# EAGLE design test2 (EAGLE 7.3.0)
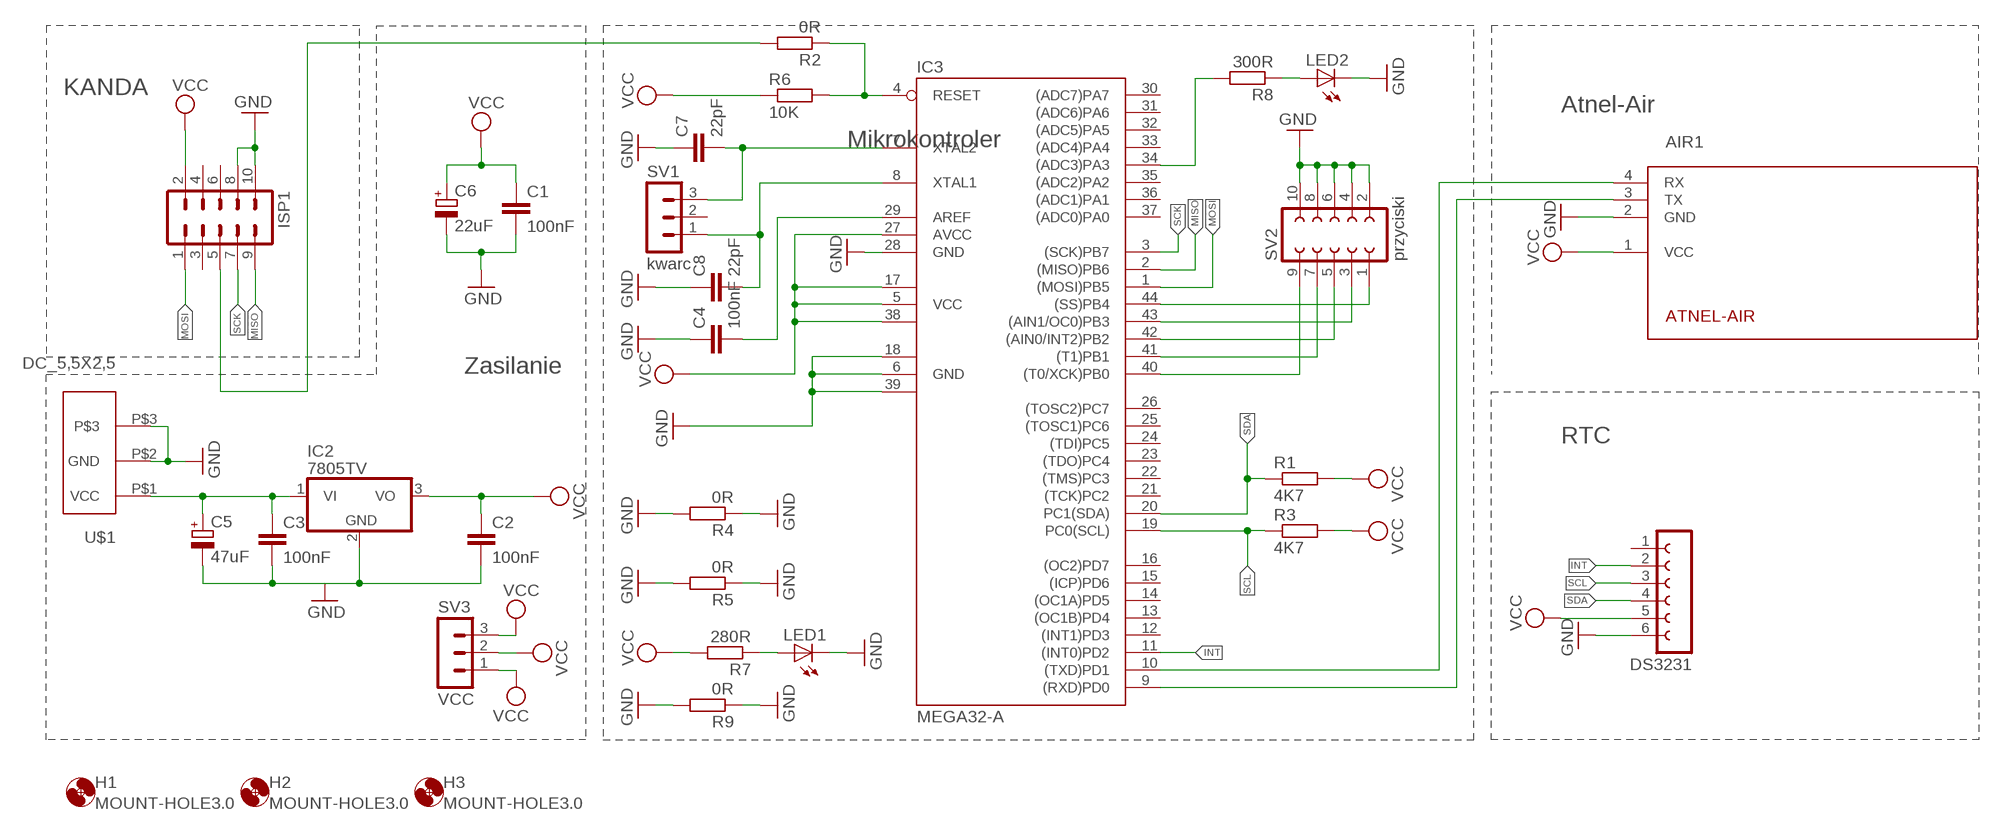
[diagram p0: schematic, sheet 1]

## Parts
AIR1  ATNEL-AIR  [ATNEL-AIR]
C1  100nF  C-EU025-024X044  [C025-024X044]
C2  100nF  C-EU025-024X044  [C025-024X044]
C3  100nF  C-EU025-024X044  [C025-024X044]
C4  100nF  C-EU025-024X044  [C025-024X044]
C5  47uF  CPOL-EUB45181A  [B45181A]
C6  22uF  CPOL-EUB45181A  [B45181A]
C7  22pF  C-EU025-024X044  [C025-024X044]
C8  22pF  C-EU025-024X044  [C025-024X044]
DS3231  FE06-1  [FE06]
H1  MOUNT-HOLE3.0  [3,0]
H2  MOUNT-HOLE3.0  [3,0]
H3  MOUNT-HOLE3.0  [3,0]
IC2  7805TV  [TO220V]
IC3  MEGA32-A  [TQFP44]
ISP1  ML10  [ML10]
LED1  LED5MM  [LED5MM]
LED2  LED5MM  [LED5MM]
R1  4K7  R-EU_R1206W  [R1206W]
R2  0R  R-EU_R1206W  [R1206W]
R3  4K7  R-EU_R1206W  [R1206W]
R4  0R  R-EU_R1206W  [R1206W]
R5  0R  R-EU_R1206W  [R1206W]
R6  10K  R-EU_R1206W  [R1206W]
R7  280R  R-EU_R1206W  [R1206W]
R8  300R  R-EU_R1206W  [R1206W]
R9  0R  R-EU_R1206W  [R1206W]
SV1  kwarc  MA03-1  [MA03-1]
SV2  przyciski  FE05-2  [FE05-2]
SV3  VCC  MA03-1  [MA03-1]
U$1  DC_5,5X2,5  [DC_5,5X2,5]

## Nets
GND: AIR1.2(GND) C1.2 C2.2 C3.2 C4.1 C5.- C6.- C7.1 C8.1 DS3231.6 IC2.2(GND) IC3.6(GND) IC3.18(GND1) IC3.28(GND) IC3.39(GND2) ISP1.8 ISP1.10 LED1.K(C) LED2.K(C) R4.1 R4.2 R5.1 R5.2 R9.1 R9.2 SV2.2 SV2.4 SV2.6 SV2.8 SV2.10 U$1.P$2(GND) U$1.P$3
INT: DS3231.2 IC3.11((INT0)PD2)
MISO: IC3.2((MISO)PB6) ISP1.9
MOSI: IC3.1((MOSI)PB5) ISP1.1
N$1: AIR1.4(RX) IC3.10((TXD)PD1)
N$2: AIR1.3(TX) IC3.9((RXD)PD0)
N$3: C4.2 IC3.29(AREF)
N$4: IC3.44((SS)PB4) SV2.1
N$5: IC3.43((AIN1/OC0)PB3) SV2.3
N$6: C3.1 C5.+ IC2.1(VI) U$1.P$1(VCC)
N$7: IC3.42((AIN0/INT2)PB2) SV2.5
N$8: IC3.41((T1)PB1) SV2.7
N$9: IC3.40((T0/XCK)PB0) SV2.9
N$10: C7.2 IC3.7(XTAL2) SV1.3
N$11: C8.2 IC3.8(XTAL1) SV1.1
N$12: LED1.A R7.1
N$16: LED2.A R8.1
N$17: IC3.34((ADC3)PA3) R8.2
RST: IC3.4(RESET) ISP1.5 R2.1 R2.2 R6.2
SCK: IC3.3((SCK)PB7) ISP1.7
SCL: DS3231.3 IC3.19(PC0(SCL)) R3.1
SDA: DS3231.4 IC3.20(PC1(SDA)) R1.1
VCC: AIR1.1(VCC) C1.1 C2.1 C6.+ DS3231.5 IC2.3(VO) IC3.5(VCC) IC3.17(VCC1) IC3.27(AVCC) IC3.38(VCC2) ISP1.2 R1.2 R3.2 R6.1 R7.2 SV3.1 SV3.2 SV3.3
Unconnected: DS3231.1 IC3.12((INT1)PD3) IC3.13((OC1B)PD4) IC3.14((OC1A)PD5) IC3.15((ICP)PD6) IC3.16((OC2)PD7) IC3.21((TCK)PC2) IC3.22((TMS)PC3) IC3.23((TDO)PC4) IC3.24((TDI)PC5) IC3.25((TOSC1)PC6) IC3.26((TOSC2)PC7) IC3.30((ADC7)PA7) IC3.31((ADC6)PA6) IC3.32((ADC5)PA5) IC3.33((ADC4)PA4) IC3.35((ADC2)PA2) IC3.36((ADC1)PA1) IC3.37((ADC0)PA0) ISP1.3 ISP1.4 ISP1.6 SV1.2

## Notes on the sheet
- KANDA
- Atnel-Air
- Mikrokontroler
- Zasilanie
- RTC

## Library data of the parts
AIR1 = ATNEL-WIFI232-T:ATNEL-AIR
C1-C4 C7 C8 = rcl:C-EU: CAPACITOR, European symbol
C5 C6 = rcl:CPOL-EU: POLARIZED CAPACITOR, European symbol
DS3231 = con-lsta:FE06-1: FEMALE HEADER; OC_FARNELL: unknown; OC_NEWARK: unknown
H1-H3 = holes:MOUNT-HOLE: MOUNTING HOLE with drill center marker
IC2 = linear:78*: Positive VOLTAGE REGULATOR Source: http://cache.national.com/ds/LM/LM78L05.pdf http://www.fairchildsemi.com/ds/LM/LM7805.pdf
IC3 = atmel:MEGA32: MICROCONTROLLER 32 Kbytes FLASH 2 Kbytes SRAM 1 Kbytes EEPROM USART 8-channel 10 bit ADC Source: www.atmel.com .. doc2503.pdf; MPN: ATMEGA32-16AU; OC_FARNELL: 9171274; OC_NEWARK: 69K6677
ISP1 = con-harting-ml:ML10: HARTING; OC_FARNELL: unknown; OC_NEWARK: unknown
LED1 LED2 = adafruit:LED: LED OSRAM: - CHIPLED LG R971, LG N971, LY N971, LG Q971, LY Q971, LO R971, LY R971 LH N974, LH R974 LS Q976, LO Q976, LY Q976 LO Q996 - Hyper CHIPLED LW Q18S LB Q993, LB Q99A, LB R99A - SideLED LS A670, LO A670, LY A670, LG A670, LP A670 LB A673, LV A673, LT A673, LW A673 LH A674 LY A675 LS A676, LA A676, LO A676, LY A676, LW A676 LS A679, LY A679, LG A679 - Hyper Micro SIDELED® LS Y876, LA Y876, LO Y876, LY Y876 LT Y87S - SmartLED LW L88C, LW L88S LB L89C, LB L89S, LG L890 LS L89K, LO L89K, LY L89K LS L896, LA L896, LO L896, LY L896 - TOPLED LS T670, LO T670, LY T670, LG T670, LP T670 LSG T670, LSP T670, LSY T670, LOP T670, LYG T670 LG T671, LOG T671, LSG T671 LB T673, LV T673, LT T673, LW T673 LH T674 LS T676, LA T676, LO T676, LY T676, LB T676, LH T676, LSB T676, LW T676 LB T67C, LV T67C, LT T67C, LS T67K, LO T67K, LY T67K, LW E67C LS E67B, LA E67B, LO E67B, LY E67B, LB E67C, LV E67C, LT E67C LW T67C LS T679, LY T679, LG T679 LS T770, LO T770, LY T770, LG T770, LP T770 LB T773, LV T773, LT T773, LW T773 LH T774 LS E675, LA E675, LY E675, LS T675 LS T776, LA T776, LO T776, LY T776, LB T776 LHGB T686 LT T68C, LB T68C - Hyper Mini TOPLED® LB M676 - Mini TOPLED Santana® LG M470 LS M47K, LO M47K, LY M47K Source: http://www.osram.convergy.de/
R1-R9 = resistor:R-EU_: RESISTOR, European symbol
SV1 SV3 = con-lstb:MA03-1: PIN HEADER; OC_FARNELL: unknown; OC_NEWARK: unknown
SV2 = con-lsta:FE05-2: FEMALE HEADER; OC_FARNELL: unknown; OC_NEWARK: unknown
U$1 = wachcio:DC_5,5X2,5

## Board
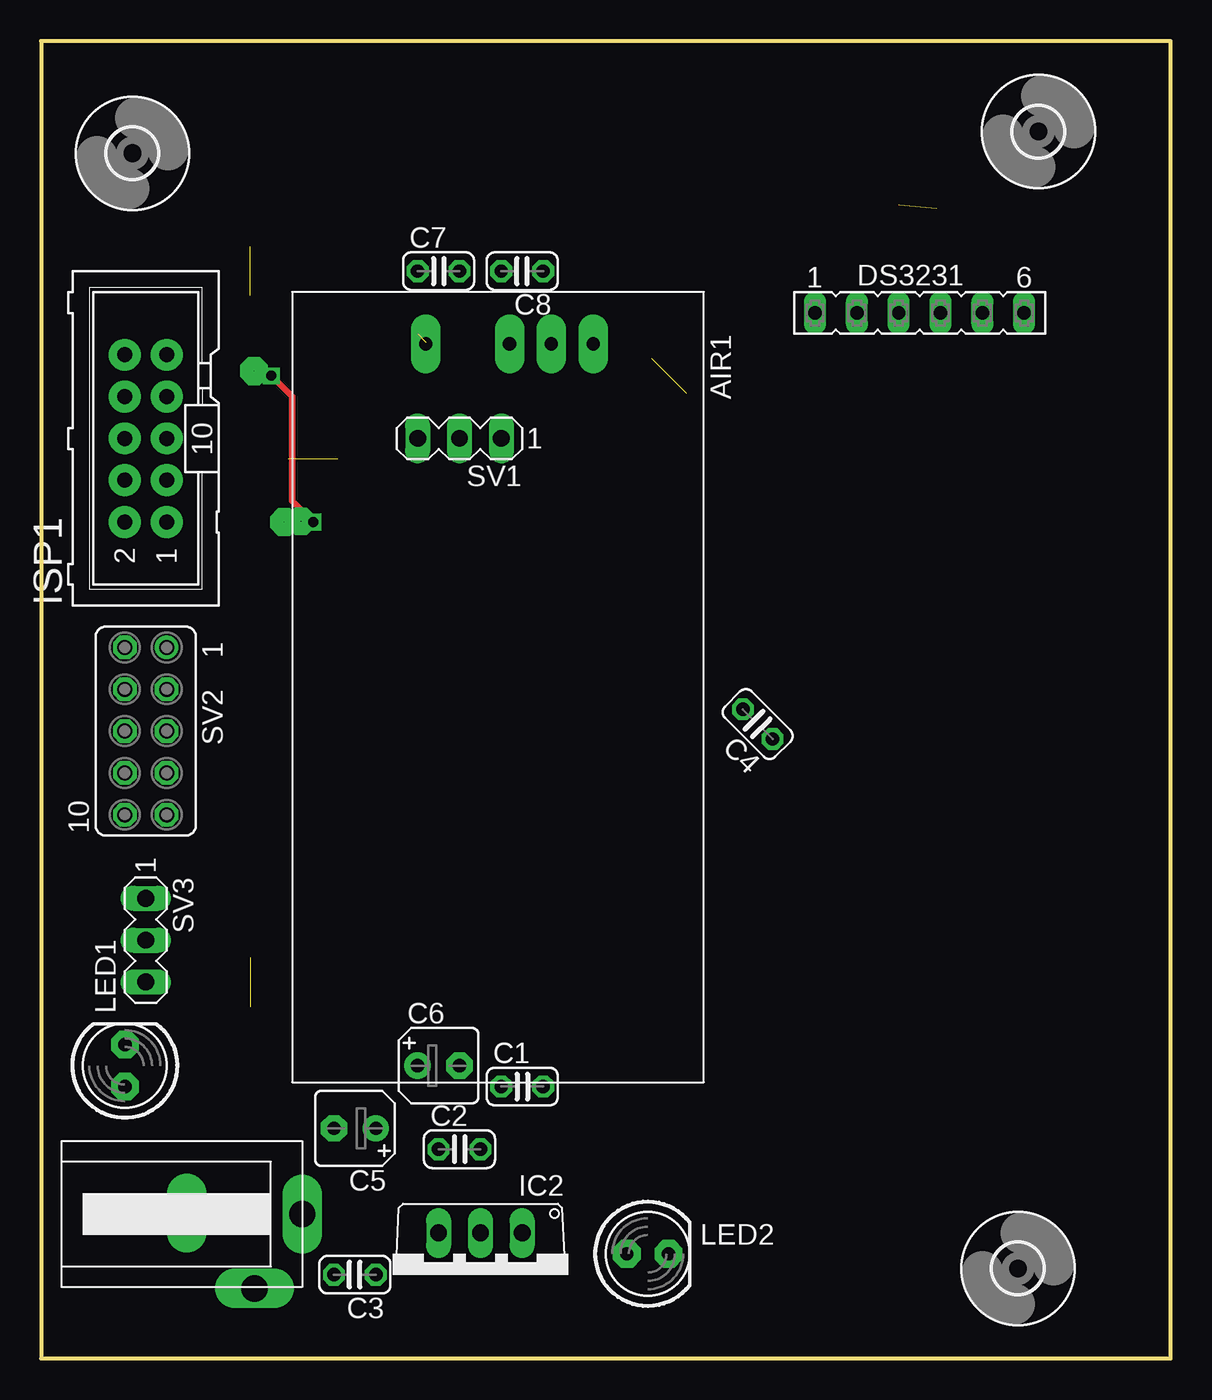
[diagram p1: board, top side]
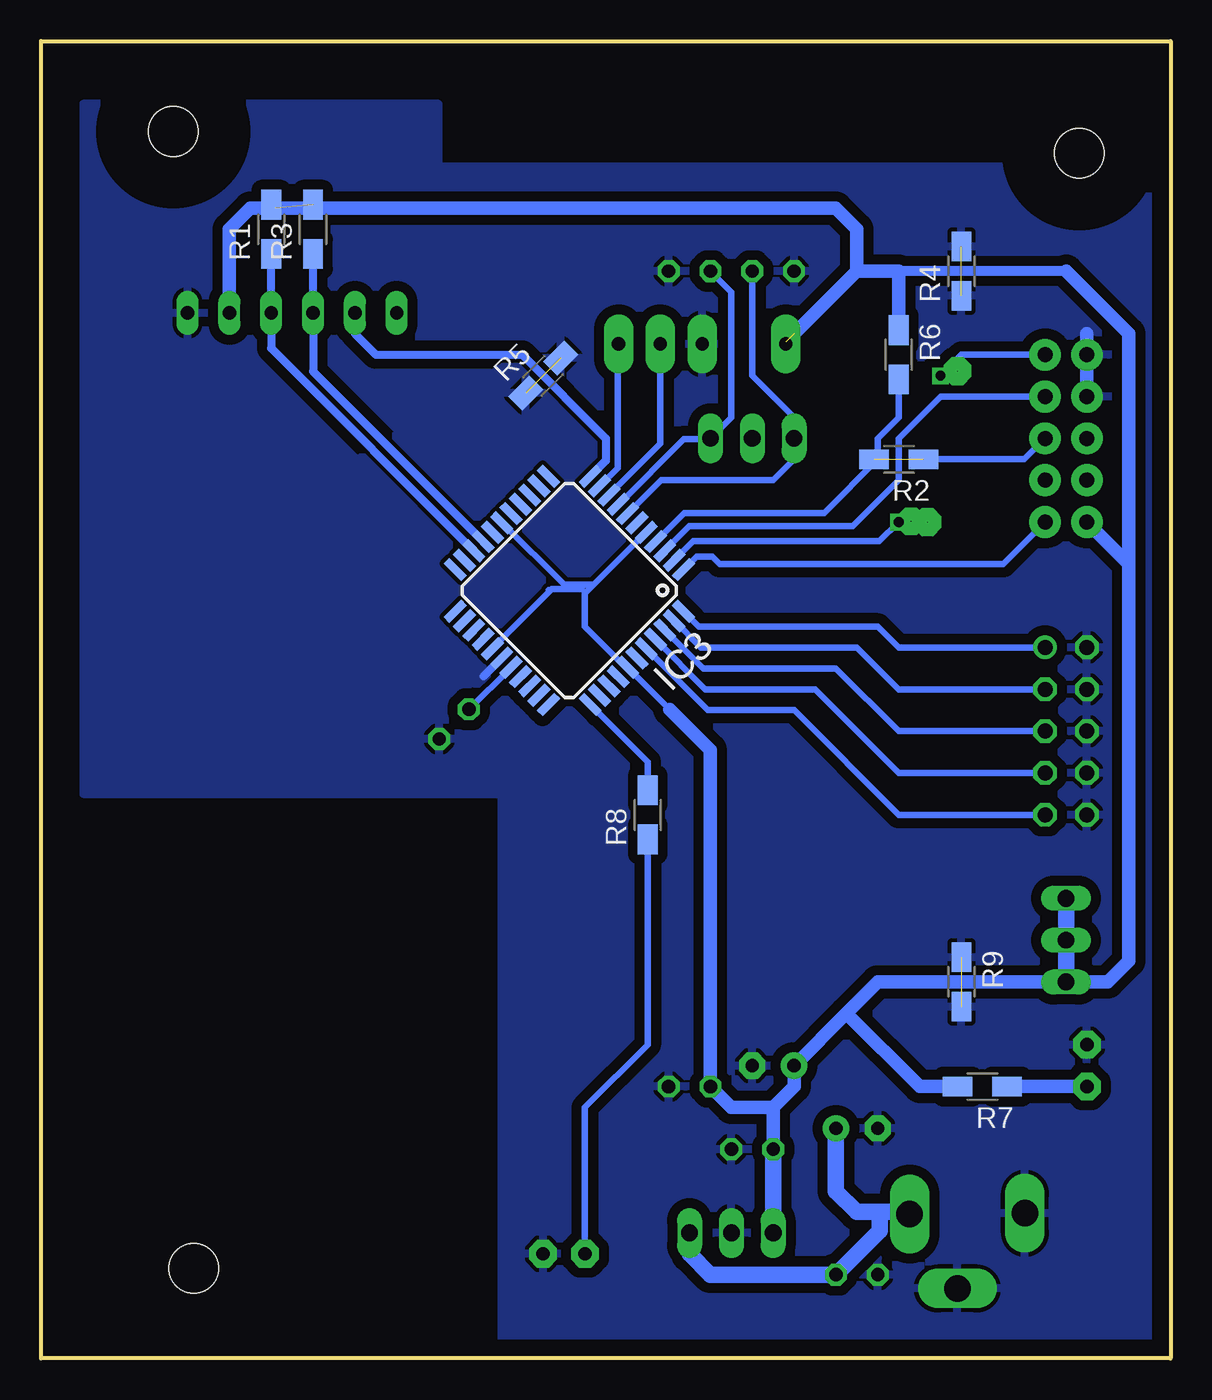
[diagram p2: board, bottom side, seen from below]

Size 68.58 x 80.01 mm. Coordinates in mm from the lower left corner, seen from the top.
Outline: 62.23,0 68.58,0
Outline: 68.58,0 0,0 0,80.01 68.58,80.01 68.58,0
Copper layers (1*16): Top 0.035mm / dielectric 1.5mm / Bottom 0.035mm
Design rules "default": minimum track width 10mil, minimum drill 24mil, track to track 8mil, track to pad 8mil, pad to pad 8mil, via to via 8mil, smd to smd 8mil, copper to edge 40mil, drill to drill 8mil, minimum pad ring 10mil, minimum via ring 8mil, stop-mask expansion 4mil, vias tented up to drill 0mil, thermal gap 10mil

### Footprints (pad centres in the part's own frame; a part is rotated, then mirrored left to right if it is on the bottom)
ATNEL-AIR = drill 0.8 pad 1.778 long: 1 3.15,8.12; 2 3.15,13.2; 3 3.15,15.74; 4 3.15,18.28
C025-024X044 = drill 0.813 octagon: 1 -1.27,0; 2 1.27,0
B45181A = drill 0.813 pad 1.6: + -1.27,0 | drill 0.813 pad 1.6 octagon: - 1.27,0
FE06 = drill 0.813 long: 1 -6.35,0; 2 -3.81,0; 3 -1.27,0; 4 1.27,0; 5 3.81,0; 6 6.35,0
3,0 = hole 3: 0,0
TO220V = drill 1.016 long: 1 -2.54,-2.54; 2 0,-2.54; 3 2.54,-2.54
TQFP44 = smd 1.5 x 0.5: 1 -5.8,4; 2 -5.8,3.2; 3 -5.8,2.4; 4 -5.8,1.6; 5 -5.8,0.8; 6 -5.8,0; 7 -5.8,-0.8; 8 -5.8,-1.6; 9 -5.8,-2.4; 10 -5.8,-3.2; 11 -5.8,-4; 23 5.8,-4; 24 5.8,-3.2; 25 5.8,-2.4; 26 5.8,-1.6; 27 5.8,-0.8; 28 5.8,0; 29 5.8,0.8; 30 5.8,1.6; 31 5.8,2.4; 32 5.8,3.2; 33 5.8,4 | smd 0.5 x 1.5: 12 -4,-5.8; 13 -3.2,-5.8; 14 -2.4,-5.8; 15 -1.6,-5.8; 16 -0.8,-5.8; 17 0,-5.8; 18 0.8,-5.8; 19 1.6,-5.8; 20 2.4,-5.8; 21 3.2,-5.8; 22 4,-5.8; 34 4,5.8; 35 3.2,5.8; 36 2.4,5.8; 37 1.6,5.8; 38 0.8,5.8; 39 0,5.8; 40 -0.8,5.8; 41 -1.6,5.8; 42 -2.4,5.8; 43 -3.2,5.8; 44 -4,5.8
ML10 = drill 0.914 pad 1.93: 1 -5.08,-1.27; 2 -5.08,1.27; 3 -2.54,-1.27; 4 -2.54,1.27; 5 0,-1.27; 6 0,1.27; 7 2.54,-1.27; 8 2.54,1.27; 9 5.08,-1.27; 10 5.08,1.27
LED5MM = drill 0.813 pad 1.676 octagon: A -1.27,0; K 1.27,0
R1206W = smd 1.8 x 1.2: 1 -1.499,0; 2 1.499,0
MA03-1 = drill 1.016 long: 1 -2.54,0; 2 0,0; 3 2.54,0
FE05-2 = drill 0.914: 1 -5.08,1.27 | drill 0.914 octagon: 2 -5.08,-1.27; 3 -2.54,1.27; 4 -2.54,-1.27; 5 0,1.27; 6 0,-1.27; 7 2.54,1.27; 8 2.54,-1.27; 9 5.08,1.27; 10 5.08,-1.27
DC_5,5X2,5 = drill 1.6 long: P$1 14.605,4.445; P$2 11.7,-0.07; P$3 7.6,4.5

### Placement (x,y rotation side)
AIR1  15.24,64.77 270 top
C1  29.21,16.51 0 top
C2  25.4,12.7 0 top
C3  19.05,5.08 180 top
C4  43.51,38.52 135 top
C5  19.05,13.97 180 top
C6  24.13,17.78 0 top
C7  24.13,66.04 0 top
C8  29.21,66.04 180 top
DS3231  53.34,63.5 0 top
H1  5.54,73.2 0 top
H2  60.55,74.52 0 top
H3  59.31,5.46 0 top
IC2  26.67,5.08 180 top
IC3  36.51,46.64 225 bottom
ISP1  6.35,55.88 90 top
LED1  5.08,17.78 90 top
LED2  36.83,6.35 0 top
R1  54.61,68.58 90 bottom
R2  16.51,54.61 180 bottom
R3  52.07,68.58 90 bottom
R4  12.7,66.04 90 bottom
R5  38.1,59.69 45 bottom
R6  16.51,60.96 270 bottom
R7  11.43,16.51 180 bottom
R8  31.75,33.02 90 bottom
R9  12.7,22.86 270 bottom
SV1  25.4,55.88 180 top
SV2  6.35,38.1 270 top
SV3  6.35,25.4 270 top
U$1  1.24,4.32 0 top

### Tracks (layer width: path | path; a pad name or v marks a point on that pad's centre or on a via)
GND  (3 unrouted)
  Bottom 0.5: IC3.28 41.73,41.43 | IC3.18 41.18,50.17 | IC3.6
  Bottom 0.813: ISP1.8 5.08,62.23
  pour Bottom (isolate 0.61): 0,0 0,72.39 44.45,72.39 44.45,76.2 66.04,76.2 66.04,34.29 40.64,34.29 40.64,0
  pour Bottom (isolate 0.254): 26.67,48.26 39.37,60.96 53.34,52.07 38.1,36.83 34.29,36.83 26.67,44.45
INT
  Bottom 0.5: DS3231.2 49.53,62.23 48.26,60.96 39.37,60.96 34.29,55.88 34.29,54.52 IC3.11
MISO  (via drill 0.6)
  Top 0.406: v16.51,50.8 15.24,52.07 15.24,58.42 v13.97,59.69
  Bottom 0.406: IC3.2 28.98,49.63 17.68,49.63 v16.51,50.8 | v13.97,59.69 12.7,60.96 ISP1.9
MOSI
  Bottom 0.406: 29.55,47.92 IC3.1 28.78,48.72 27.84,48.72 27.38,48.26 10.16,48.26 ISP1.1
N$1
  Bottom 0.406: IC3.10 34.65,53.01 33.58,54.08 33.58,61.56 AIR1.4
N$2
  Bottom 0.406: AIR1.3 30.98,55.57 IC3.9
N$3
  Bottom 0.406: C4.2 42.65,39.37 IC3.29
N$4
  Bottom 0.406: SV2.1 16.51,43.18 17.78,44.45 28.66,44.45 IC3.44
N$5
  Bottom 0.406: SV2.3 16.51,40.64 19.05,43.18 28.52,43.18 IC3.43
N$6
  Bottom 0.61: 17.65,8.76 U$1.P$1 15.98,8.89
  Bottom 1.016: IC2.1 29.21,6.35 27.94,5.08 C3.1 17.65,7.75 17.65,8.76 | C5.+ 20.32,10.16 19.05,8.89 15.98,8.89
N$7
  Bottom 0.406: SV2.5 16.51,38.1 20.32,41.91 28.38,41.91 IC3.42
N$8
  Bottom 0.406: SV2.7 16.51,35.56 21.59,40.64 28.24,40.64 IC3.41
N$9
  Bottom 0.406: SV2.9 16.51,33.02 22.86,39.37 28.1,39.37 IC3.40
N$10
  Bottom 0.406: IC3.7 30.94,53.34 24.13,53.34 22.86,54.61 SV1.3 22.86,57.15 25.4,59.69 C7.2
N$11
  Bottom 0.406: IC3.8 33.52,51.88 29.57,55.83 27.99,55.83 SV1.1 26.67,57.15 26.67,64.77 C8.2
N$12
  Bottom 0.813: R7.1 LED1.A
N$13  (via drill 0.03 pad 1.68)
  other vias: 12.93,59.97
N$14  (via drill 0.03 pad 1.68)
  other vias: 15.77,50.85
N$15  (via drill 0.03 pad 1.68)
  other vias: 14.76,50.8
N$16
  Bottom 0.406: R8.1 31.75,19.05 35.56,15.24 LED2.A
N$17
  Bottom 0.406: R8.2 31.75,36.23 IC3.34
RST  (2 unrouted)
  Bottom 0.406: 31.21,49.69 31.21,49.61 IC3.4 29.53,51.36 21.03,51.36 17.78,54.61 17.78,55.88 16.51,57.15 R6.2 | R2.1 8.89,54.61 ISP1.5
SCK
  Bottom 0.406: IC3.3 30.71,49.07 29.23,50.55 19.3,50.55 16.51,53.34 16.51,55.88 13.97,58.42 ISP1.7
SCL
  Bottom 0.5: IC3.19 52.07,59.94 DS3231.3 R3.1
SDA
  Bottom 0.5: IC3.20 54.61,61.35 DS3231.4 R1.1
VCC  (2 unrouted)
  Bottom 0.406: 30.42,39.43 IC3.38 33.09,41.98 35.56,44.45 35.56,46.46 35.03,46.99 | 35.03,46.99 IC3.5 | 35.56,46.99 36.83,46.99 40.59,50.74 IC3.17 40.61,50.77 | 35.56,46.99 35.03,46.99 | IC3.27 41.18,43.13 37.71,46.6 | 37.71,46.6 37.57,46.74 35.81,46.74 35.56,46.99 | 37.77,46.66 37.71,46.6 | AIR1.1 23.36,61.73
  Bottom 0.61: 6.35,66.04 16.51,66.04
  Bottom 0.813: C2.1 24.13,15.24 | 24.13,15.24 22.86,16.51 C6.+ 19.68,20.95 | 24.13,15.24 26.67,15.24 C1.1 27.94,36.94 30.42,39.43 | 2.54,48.26 2.54,24.13 3.81,22.86 SV3.3 17.78,22.86 19.68,20.95 | 2.54,48.26 2.54,62.23 6.35,66.04 | 19.05,66.04 16.51,66.04 R6.1 | 54.38,69.85 R1.2 | 54.38,69.85 55.88,69.85 57.15,68.58 DS3231.5 | ISP1.2 2.54,48.26 | 22.86,62.23 19.05,66.04 | 19.05,66.04 19.05,68.58 20.32,69.85 54.38,69.85 | R7.2 15.24,16.51 19.68,20.95
  Bottom 1.016: SV3.3 SV3.2 SV3.1 | IC2.3 C2.1

### Text on the board
bTest: Wachcio 2016-05-10